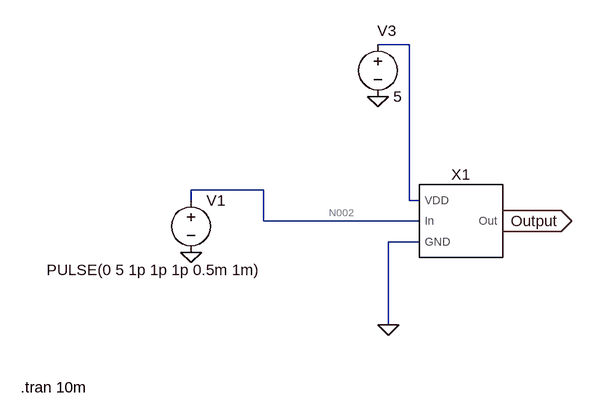
[diagram p0: schematic NOT test.asc]
NOT test.asc, the LTspice schematic file:
Version 4
SHEET 1 880 680
WIRE 240 -96 192 -96
WIRE 16 128 -96 128
WIRE -96 144 -96 128
WIRE 240 144 240 -96
WIRE 256 144 240 144
WIRE 16 176 16 128
WIRE 256 176 16 176
WIRE 256 208 208 208
WIRE 208 336 208 208
FLAG -96 224 0
FLAG 208 336 0
FLAG 192 -16 0
FLAG 384 176 Output
IOPIN 384 176 Out
SYMBOL voltage -96 128 R0
WINDOW 123 0 0 Left 0
WINDOW 39 0 0 Left 0
WINDOW 3 -222 123 Left 2
SYMATTR InstName V1
SYMATTR Value PULSE(0 5 1p 1p 1p 0.5m 1m)
SYMBOL voltage 192 -112 R0
WINDOW 123 0 0 Left 0
WINDOW 39 0 0 Left 0
WINDOW 0 -1 -5 Left 2
SYMATTR InstName V3
SYMATTR Value 5
SYMBOL NOT 320 176 R0
SYMATTR InstName X1
TEXT -358 432 Left 2 !.tran 10m

The netlist it stands for:
* NOT test.asc
V1 N002 0 PULSE(0 5 1p 1p 1p 0.5m 1m)
V3 N001 0 5
XX1 0 N002 N001 Output NOT  ; pins GND In VDD Out
.tran 10m
.backanno
.end

* Results of the author's LTspice run, read from the files saved beside the schematic
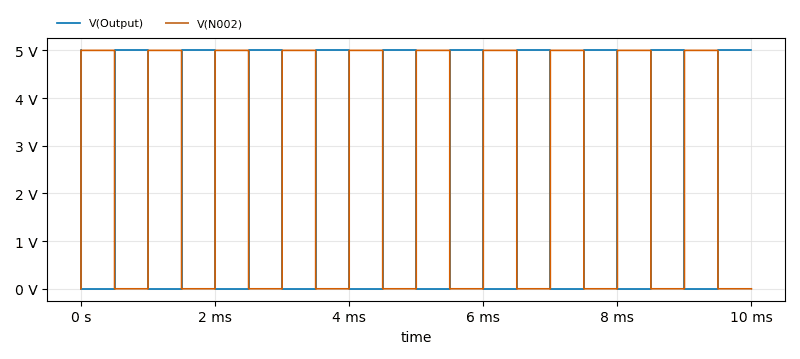
[diagram p1: Transient Analysis of NOT test.asc, plotted from the saved traces]
* Transient Analysis, 1 run:
*   V(Output): min 0 V, max 5 V, average 2.5 V, rms 3.536 V, last 5 V
*   V(N002): min 0 V, max 5 V, average 2.5 V, rms 3.536 V, last 0 V